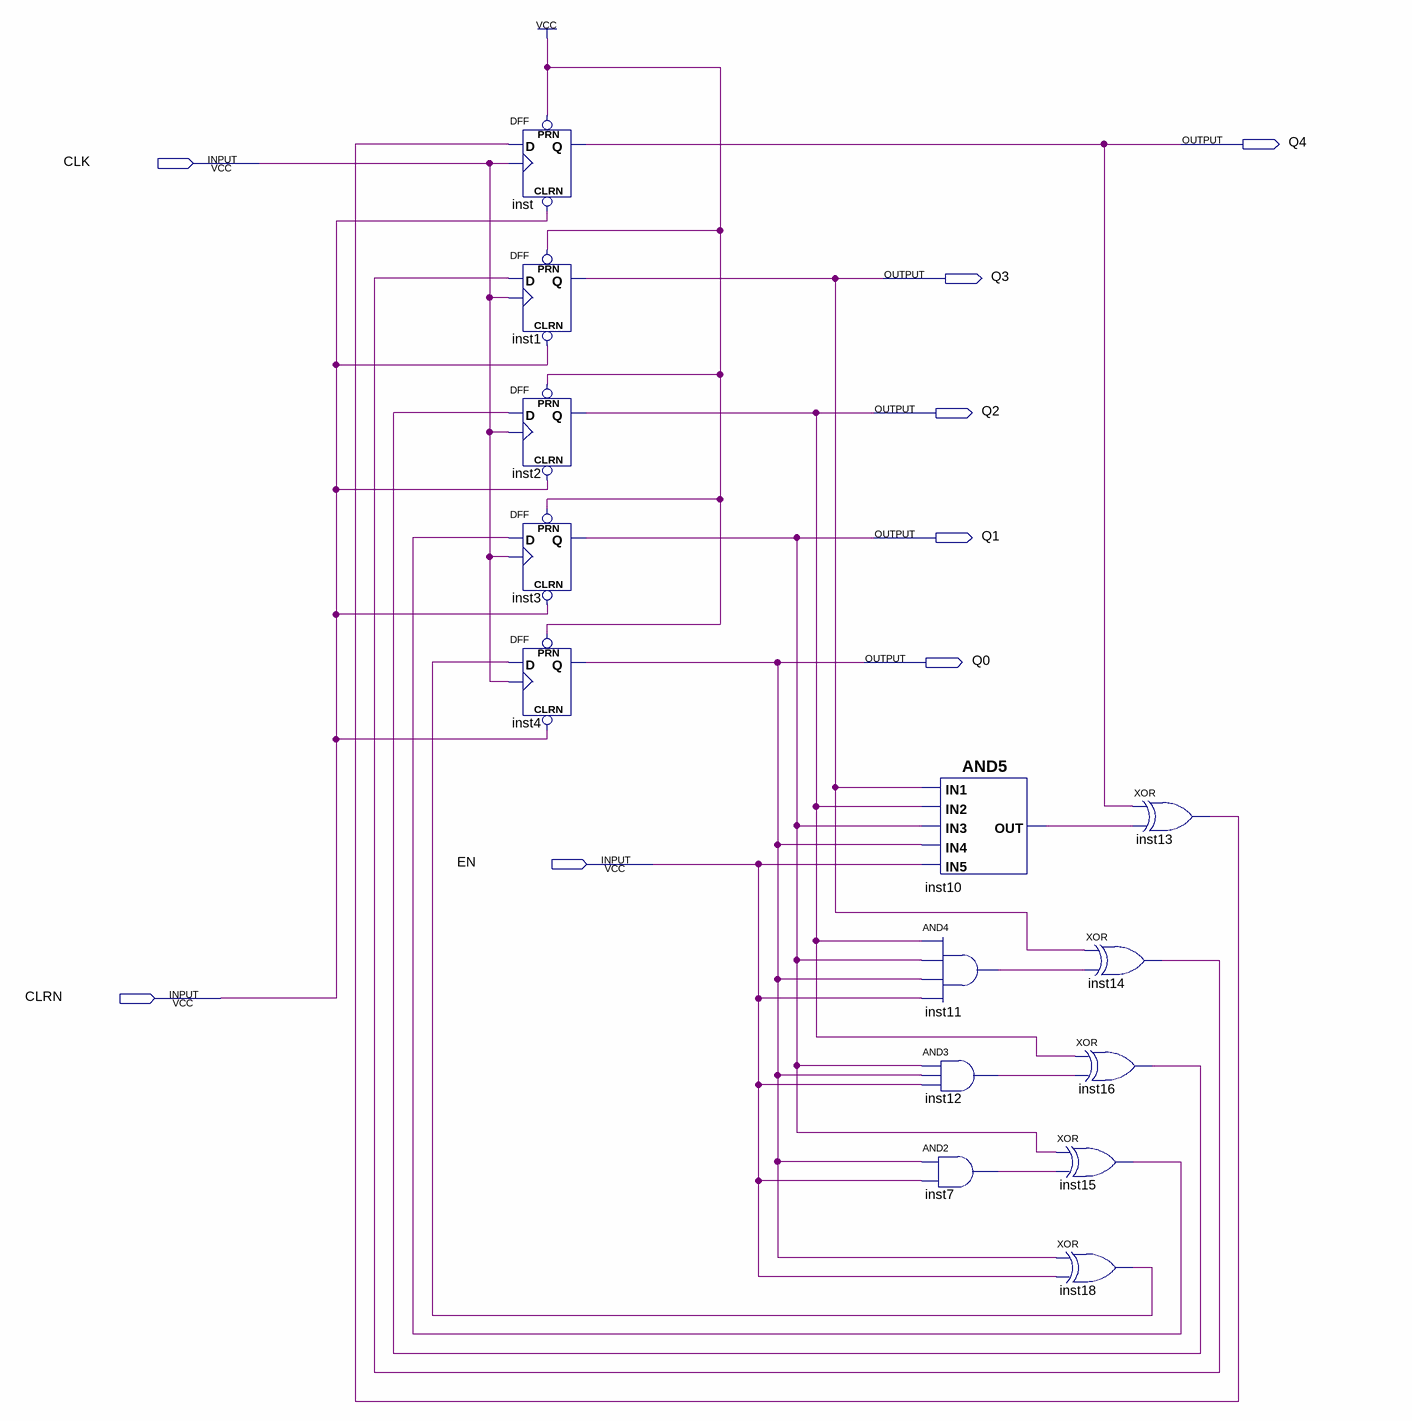
[diagram p0: schematic sheet]
// Quartus schematic Block5.bdf as structural Verilog: 14 symbols, 8 pins
module Block5 (
  input  CLK,
  input  EN,
  input  CLRN,
  output Q4,
  output Q3,
  output Q2,
  output Q1,
  output Q0
);

  wire inst7_out, inst10_out, inst11_out, inst12_out, inst13_out, inst14_out, inst15_out, inst16_out,
       inst18_out;

  DFF inst (.CLRN(CLRN), .CLK(CLK), .D(inst13_out), .PRN(1'b1), .Q(Q4));
  DFF inst1 (.CLRN(CLRN), .CLK(CLK), .D(inst14_out), .PRN(1'b1), .Q(Q3));
  DFF inst2 (.CLRN(CLRN), .CLK(CLK), .D(inst16_out), .PRN(1'b1), .Q(Q2));
  DFF inst3 (.CLRN(CLRN), .CLK(CLK), .D(inst15_out), .PRN(1'b1), .Q(Q1));
  DFF inst4 (.CLRN(CLRN), .CLK(CLK), .D(inst18_out), .PRN(1'b1), .Q(Q0));
  and inst10 (inst10_out, Q3, Q2, Q1, Q0, EN);
  and inst11 (inst11_out, Q2, Q1, Q0, EN);
  and inst12 (inst12_out, Q1, Q0, EN);
  and inst7 (inst7_out, Q0, EN);
  xor inst14 (inst14_out, Q3, inst11_out);
  xor inst16 (inst16_out, Q2, inst12_out);
  xor inst15 (inst15_out, Q1, inst7_out);
  xor inst18 (inst18_out, Q0, EN);
  xor inst13 (inst13_out, Q4, inst10_out);
endmodule
